# Altium schematic sheet CH2-Isolation.SchDoc: CH2 ISOLATION
size A4; Author: MOG; CompanyName: GIE GROUP; DrawnBy: MOG; Organization: Gie SA; Address1: Galicia 52; Address2: Mar del Plata; Address3: Buenos Aires; Address4: Argentina; DocumentNumber: 5; Revision: 0.0; SheetNumber: 6; SheetTotal: 14; Project: CP DATALOGGER; PageSetup: Record=PageOptions|CenterHorizontal=True|CenterVertical=True|PrintScale=0.94|XCorrection=1.00|YCorrection=1.00|PrintKind=0|BorderSize=5000000|LeftOffset=0|BottomOffset=0|Orientation=2|PaperLength=1000|PaperWidth=1000|Scale=100|PaperSource=7|PrintQuality=720|MediaType=1|DitherType=10|PaperKind=A4|PrintScaleMode=1
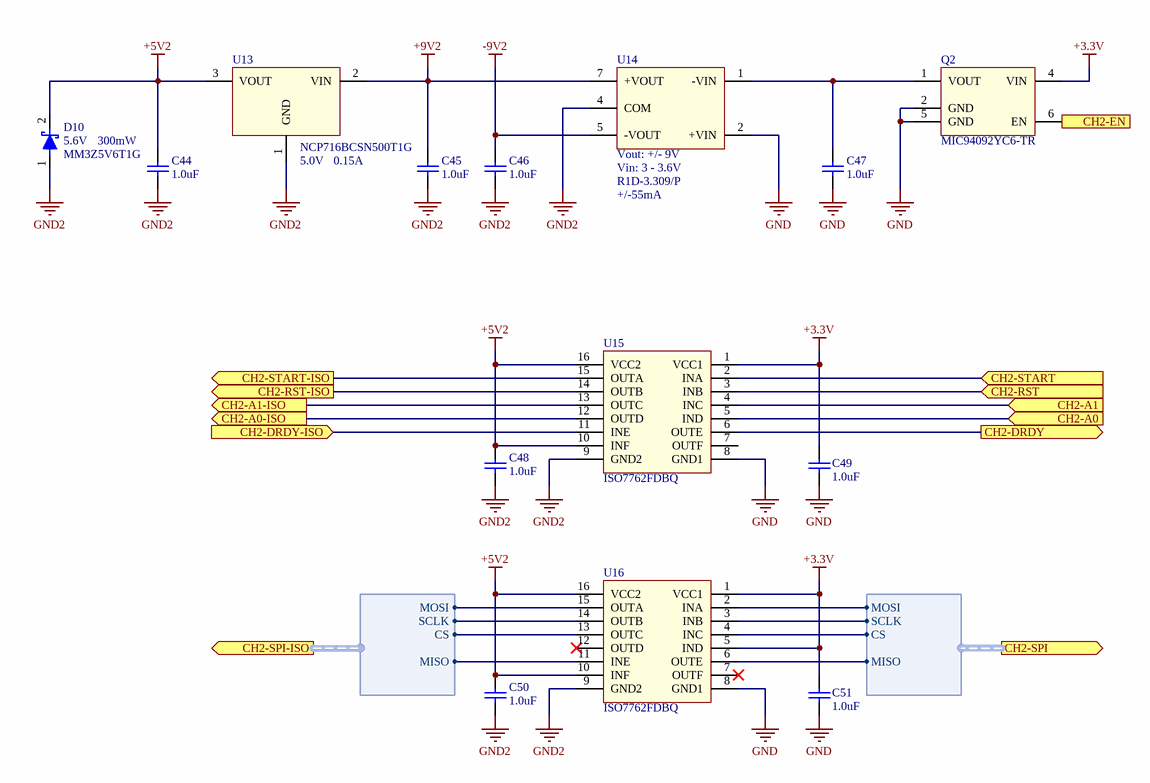
[diagram p0: CH2-Isolation.SchDoc]

## Parts
C44  value 1.0uF  [CAP-0603]  (hidden comment: C0603C105M3RAC7867)
C45  value 1.0uF  [CAP-0603]  (hidden comment: C0603C105M3RAC7867)
C46  value 1.0uF  [CAP-0603]  (hidden comment: C0603C105M3RAC7867)
C47  value 1.0uF  [CAP-0603]  (hidden comment: C0603C105M3RAC7867)
C48  value 1.0uF  [CAP-0603]  (hidden comment: C0603C105M3RAC7867)
C49  value 1.0uF  [CAP-0603]  (hidden comment: C0603C105M3RAC7867)
C50  value 1.0uF  [CAP-0603]  (hidden comment: C0603C105M3RAC7867)
C51  value 1.0uF  [CAP-0603]  (hidden comment: C0603C105M3RAC7867)
D10  Power: 300mW  Vz: 5.6V  [SOD323 - DIODE UNIDIR]  (hidden comment: MM3Z5V6T1G)
Q2  MIC94092YC6-TR  [TSSOP6]
U13  Voltage: 5.0V  Current: 0.15A  [SOT23-5]  (hidden comment: NCP716BCSN500T1G)
U14  Vout: +/- 9V  Vin: 3 - 3.6V  Current: +/-55mA  [RECOM-R1D]  (hidden comment: R1D-3.309/P)
U15  ISO7762FDBQ  [SSOP16]
U16  ISO7762FDBQ  [SSOP16]

## Ports
CH2-A0 (in), CH2-A0-ISO (out), CH2-A1 (in), CH2-A1-ISO (out), CH2-DRDY (out), CH2-DRDY-ISO (in), CH2-EN (in), CH2-RST (in), CH2-RST-ISO (out), CH2-SPI (out, harness CH2-SPI), CH2-SPI-ISO (out, harness CH2-SPI-ISO), CH2-START (in), CH2-START-ISO (out)

## Harnesses
CH2-SPI-ISO: MOSI, MISO, SCLK, CS
CH2-SPI: MOSI, MISO, SCLK, CS

## Nets
+3.3V: C49.2 C51.2 Q2.4(VIN) U15.1(VCC1) U16.1(VCC1) U16.5(IND)
+5V2: C44.2 C48.2 C50.2 D10.2(K) U13.3(VOUT) U15.10(INF) U15.16(VCC2) U16.10(INF) U16.16(VCC2)
+9V2: C45.2 U13.2(VIN) U14.7(+VOUT)
-9V2: C46.2 U14.5(-VOUT)
GND: C47.1 C49.1 C51.1 Q2.2(GND) Q2.5(GND) U14.2(+VIN) U15.8(GND1) U16.8(GND1)
GND2: C44.1 C45.1 C46.1 C48.1 C50.1 D10.1(A) U13.1(GND) U14.4(COM) U15.9(GND2) U16.9(GND2)
CH2-A0: U15.5(IND) ; port CH2-A0
CH2-A0-ISO: U15.12(OUTD) ; port CH2-A0-ISO
CH2-A1: U15.4(INC) ; port CH2-A1
CH2-A1-ISO: U15.13(OUTC) ; port CH2-A1-ISO
CH2-DRDY: U15.6(OUTE) ; port CH2-DRDY
CH2-DRDY-ISO: U15.11(INE) ; port CH2-DRDY-ISO
CH2-EN: Q2.6(EN) ; port CH2-EN
CH2-RST: U15.3(INB) ; port CH2-RST
CH2-RST-ISO: U15.14(OUTB) ; port CH2-RST-ISO
CH2-START: U15.2(INA) ; port CH2-START
CH2-START-ISO: U15.15(OUTA) ; port CH2-START-ISO
NetC47_2: C47.2 Q2.1(VOUT) U14.1(-VIN)
NetU16_2: U16.2(INA) ; port CH2-SPI.MOSI
NetU16_3: U16.3(INB) ; port CH2-SPI.SCLK
NetU16_4: U16.4(INC) ; port CH2-SPI.CS
NetU16_6: U16.6(OUTE) ; port CH2-SPI.MISO
NetU16_11: U16.11(INE) ; port CH2-SPI-ISO.MISO
NetU16_13: U16.13(OUTC) ; port CH2-SPI-ISO.CS
NetU16_14: U16.14(OUTB) ; port CH2-SPI-ISO.SCLK
NetU16_15: U16.15(OUTA) ; port CH2-SPI-ISO.MOSI

Not connected (* = marked no-connect by the designer): U15 7(OUTF); U16 7(OUTF)* 12(OUTD)*

## Notes on the sheet
- PROYECTO:
- Rev:
- NOMBRE:
- FECHA:
- REALIZO:
- REVISO:
- APROBO:
- PAG:
- HOJA:
- DE
- A4

## Library data of the parts
C44-C51 = C0603C105M3RAC7867: CAP CER 1uF 25V X7R 0603; Manufacturer: Kemet; Tolerance: 20%; Voltage: 25; PartNumber: C0603C105M3RAC7867; Supplier 1: Digi-Key; Supplier 2: Mouser; Supplier Part Number 1: 399-C0603C105M3RAC7867CT-ND; Supplier Part Number 2: 80-C0603C105M3R
D10 = MM3Z5V6T1G: Schottky Diode 30V 200mA SOT323; Manufacturer: OnSemiconductor; PartNumber: MM3Z5V6T1G
Q2 = MIC94092YC6-TR: Manufacturer: Microchip; PartNUmber: MIC94092YC6-TR
U13 = NCP716BCSN500T1G: IC REG LDO 0.5V 0.15A TSOT23-5; Manufacturer: ON Semiconductor; PartNumber: NCP716BCSN500T1G
U14 = R1D-3.309/P: DC DC CONVERTER +/-9V 1W; Manufacturer: Recom; Supplier 1: Digi-Key; Supplier 2: Mouser; Supplier Part Number 1: R1D-3.309/P-ND; Supplier Part Number 2: 919-R1D-3.309P; Part Number: R1D-3.309/P
U15 U16 = ISO7762FDBQ: Digital Isolator, six-channel, 4/2, 16-SSOP; Manufacturer: Texas Instruments; Supplier 1: Digi-Key; Supplier 2: Mouser; Supplier Part Number 1: 296-49452-6-ND; Supplier Part Number 2: 595-ISO7762FDBQR; PartNumber: ISO7762FDBQ